# EAGLE schematic fermenter_mega (EAGLE 8.3.2)
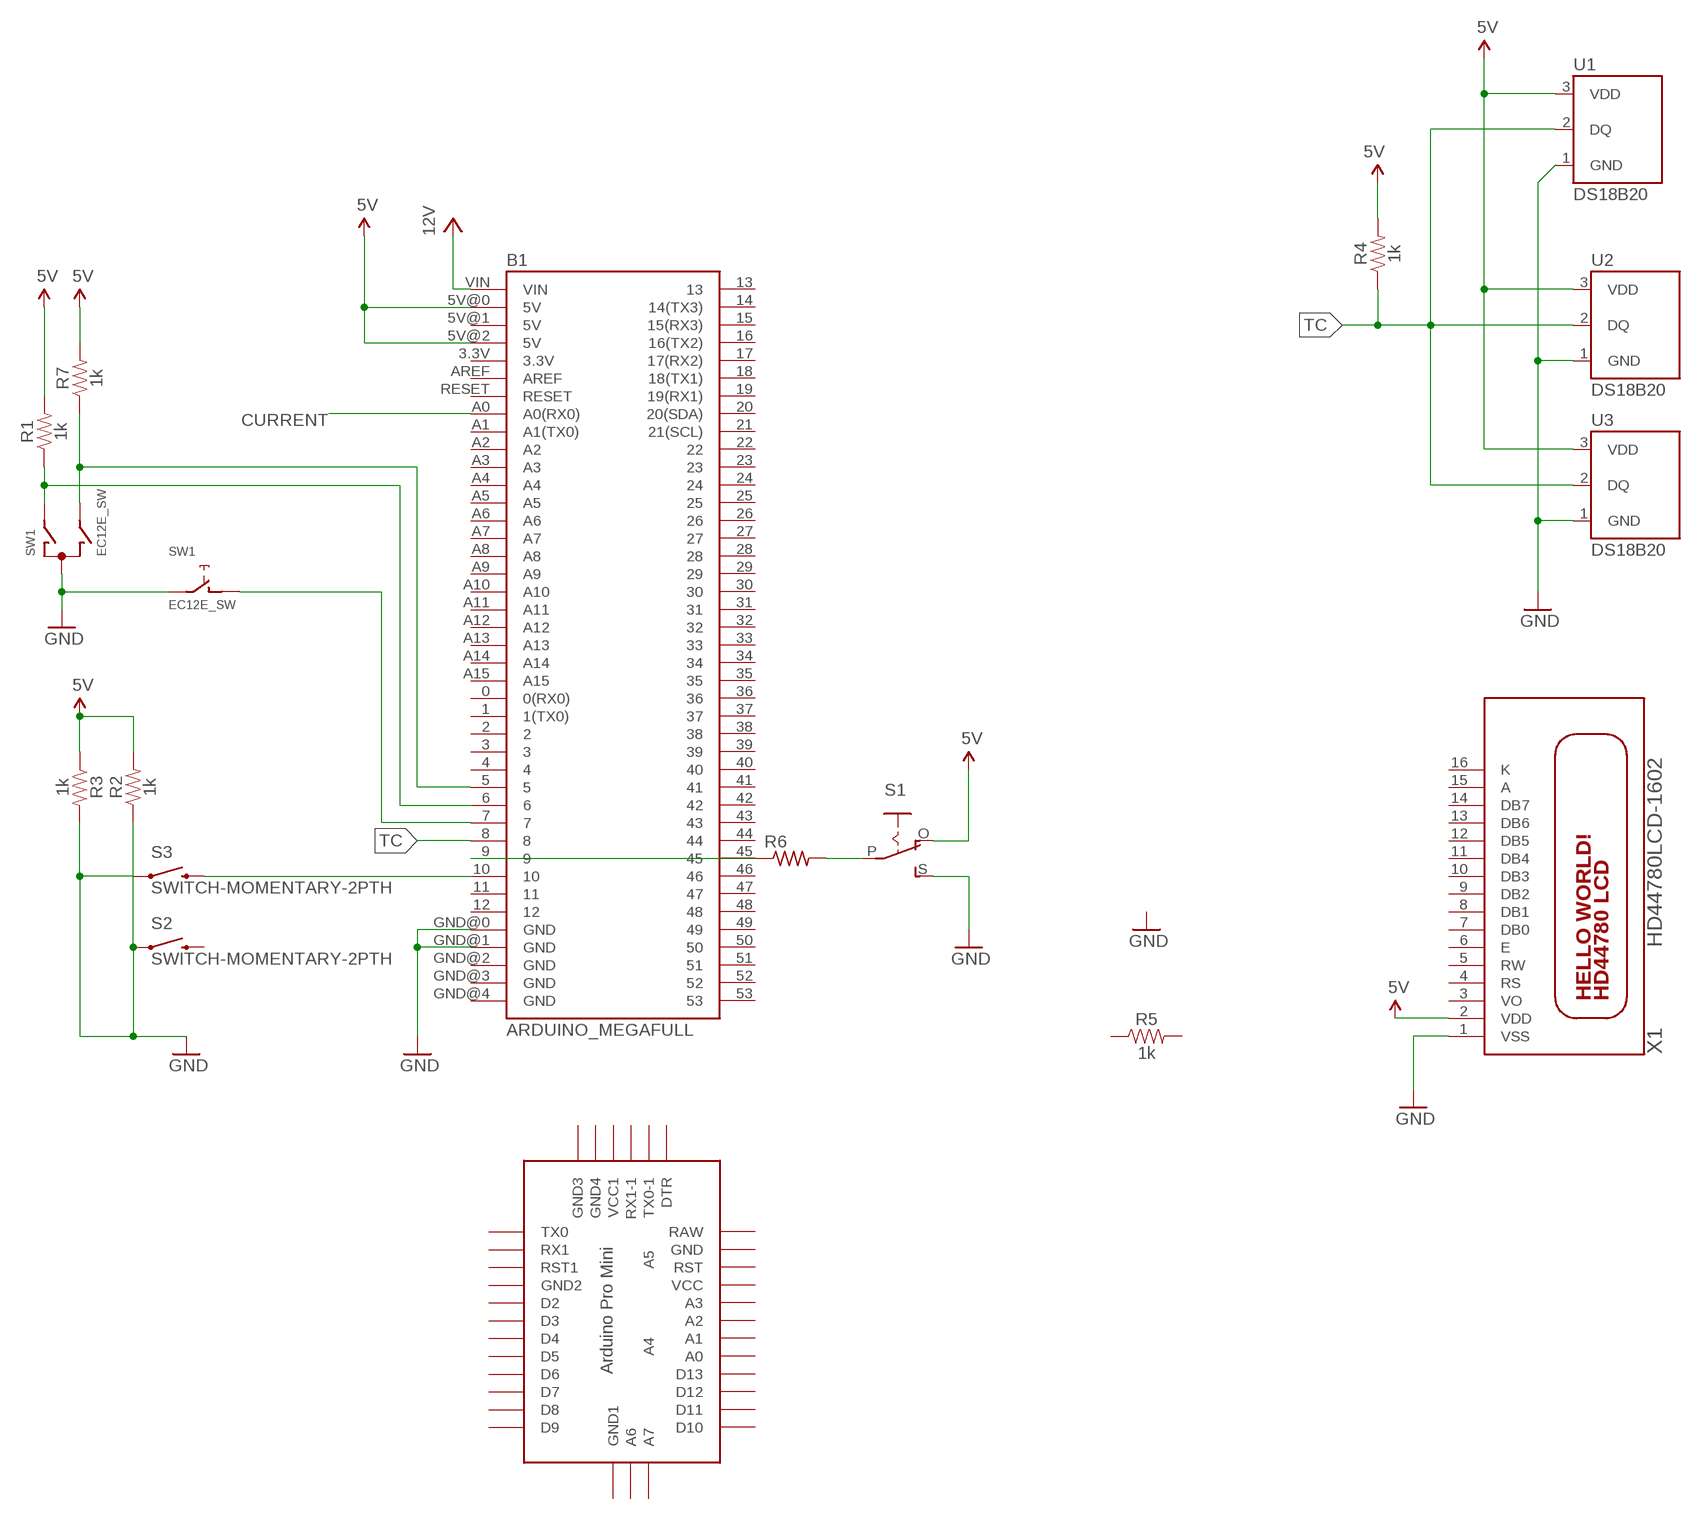
[diagram p0: schematic, sheet 1]

## Parts
B1  ARDUINO_MEGAFULL  [ARDUINO_MEGA]
R1  1k  1KOHM-HORIZ-1/4W-1%  [AXIAL-0.3]
R2  1k  1KOHM-HORIZ-1/4W-1%  [AXIAL-0.3]
R3  1k  1KOHM-HORIZ-1/4W-1%  [AXIAL-0.3]
R4  1k  1KOHM-HORIZ-1/4W-1%  [AXIAL-0.3]
R5  1k  1KOHM-HORIZ-1/4W-1%  [AXIAL-0.3]
R6  R-US_FLIPFLOP  [0805-THM]
R7  1k  1KOHM-HORIZ-1/4W-1%  [AXIAL-0.3]
S1  EG1218S  [EG1218]
S2  SWITCH-MOMENTARY-2PTH  [TACTILE-PTH]
S3  SWITCH-MOMENTARY-2PTH  [TACTILE-PTH]
SW1  EC12E_SW  [ALPS_EC12E_SW]
U1  DS18B20  [TO-92-AMMO]
U2  DS18B20  [TO-92-AMMO]
U3  DS18B20  [TO-92-AMMO]
U$1  ABK-PRO-MINI  [ABK-PRO-MINI]
X1  HD44780LCD-1602  [LCD1602]

## Nets
5V: B1.5V@0(5V) B1.5V@2(5V) R1.P$2 R2.P$2 R3.P$1 R4.P$2 R7.P$2 S1.O U1.3(VDD) U2.3(VDD) U3.3(VDD) X1.2(VDD)
CURRENT: B1.A0(A0(RX0))
GND: B1.GND@0(GND) B1.GND@1(GND) R2.P$1 R3.P$2 S1.S S2.1 S3.1 SW1.C SW1.E U1.1(GND) U2.1(GND) U3.1(GND) X1.1(VSS)
N$1: B1.9 R6.1
N$2: B1.10 S3.3
N$3: B1.7 SW1.D
N$4: B1.6 R1.P$1 SW1.A
N$5: B1.5 R7.P$1 SW1.B
N$6: R6.2 S1.P
TC: B1.8 R4.P$1 U1.2(DQ) U2.2(DQ) U3.2(DQ)
VCC: B1.VIN ; supply symbol labelled 12V
Unconnected: B1.0(0(RX0)) B1.1(1(TX0)) B1.2 B1.3 B1.3.3V B1.4 B1.5V@1(5V) B1.11 B1.12 B1.13 B1.14(14(TX3)) B1.15(15(RX3)) B1.16(16(TX2)) B1.17(17(RX2)) B1.18(18(TX1)) B1.19(19(RX1)) B1.20(20(SDA)) B1.21(21(SCL)) B1.22 B1.23 B1.24 B1.25 B1.26 B1.27 B1.28 B1.29 B1.30 B1.31 B1.32 B1.33 B1.34 B1.35 B1.36 B1.37 B1.38 B1.39 B1.40 B1.41 B1.42 B1.43 B1.44 B1.45 B1.46 B1.47 B1.48 B1.49 B1.50 B1.51 B1.52 B1.53 B1.A1(A1(TX0)) B1.A2 B1.A3 B1.A4 B1.A5 B1.A6 B1.A7 B1.A8 B1.A9 B1.A10 B1.A11 B1.A12 B1.A13 B1.A14 B1.A15 B1.AREF B1.GND@2(GND) B1.GND@3(GND) B1.GND@4(GND) B1.RESET R5.P$1 R5.P$2 S2.3 SW1.GND1(G) SW1.GND2(G) U$1.A0 U$1.A1 U$1.A2 U$1.A3 U$1.A4 U$1.A5 U$1.A6 U$1.A7 U$1.D2 U$1.D3 U$1.D4 U$1.D5 U$1.D6 U$1.D7 U$1.D8 U$1.D9 U$1.D10 U$1.D11 U$1.D12 U$1.D13 U$1.DTR U$1.GND U$1.GND1(GND2) U$1.GND2(GND3) U$1.GND3(GND4) U$1.GND4(GND1) U$1.RAW U$1.RST U$1.RST1 U$1.RX1 U$1.RX1-1 U$1.TX0 U$1.TX0-1 U$1.VCC U$1.VCC1 X1.3(VO) X1.4(RS) X1.5(RW) X1.6(E) X1.7(DB0) X1.8(DB1) X1.9(DB2) X1.10(DB3) X1.11(DB4) X1.12(DB5) X1.13(DB6) X1.14(DB7) X1.15(A) X1.16(K)

## Library data of the parts
B1 = SparkFun-Boards:ARDUINO_MEGA: Arduino Mega R3 ATmega2560 R3 compatible footprint. SparkFun Products: Arduino Mega 2560 R3 <https://www.sparkfun.com/products/11061>
R1-R5 R7 = SparkFun-Resistors:1KOHM: 1kΩ resistor A resistor is a passive two-terminal electrical component that implements electrical resistance as a circuit element. Resistors act to reduce current flow, and, at the same time, act to lower voltage levels within circuits.; PROD_ID: RES-12182
R6 = adafruit:R-US_: RESISTOR, American symbol
S1 = adafruit:EG1218: SLIDING SWITCH 0.1" spacing through hole, vertical SPDT slide switch http://www.ladyada.net/library/pcb/eaglelibrary.html
S2 S3 = SparkFun-Electromechanical:SWITCH-MOMENTARY-2: Various NO switches- pushbuttons, reed, etc; PROD_ID: SWCH-08441
SW1 = switch-alps:EC12E_SW: ALPS rotary Encoder EC12E series with switch; MPN: EC12E2424407; OC_FARNELL: 1520813; OC_NEWARK: 74M1068
U1-U3 = SparkFun-Sensors:DS18B20: Dallas/Maxim DS18B20 1-wire temperature sensor Datasheet: http://datasheets.maximintegrated.com/en/ds/DS18B20.pdf temp thermometer 1-wire one-wire one wire; STORE_ID: SEN-00245
U$1 = Arduino-clone:ABK-PRO-MINI: ABK Pro-Mini Arduino Clone
X1 = adafruit:HD44780LCD: HD44780 LCD Standard character type LCDs, available in sizes from 8x1 to 40x4!